# EAGLE design Aruduino-Kids-Shiled (EAGLE 6.6.0)
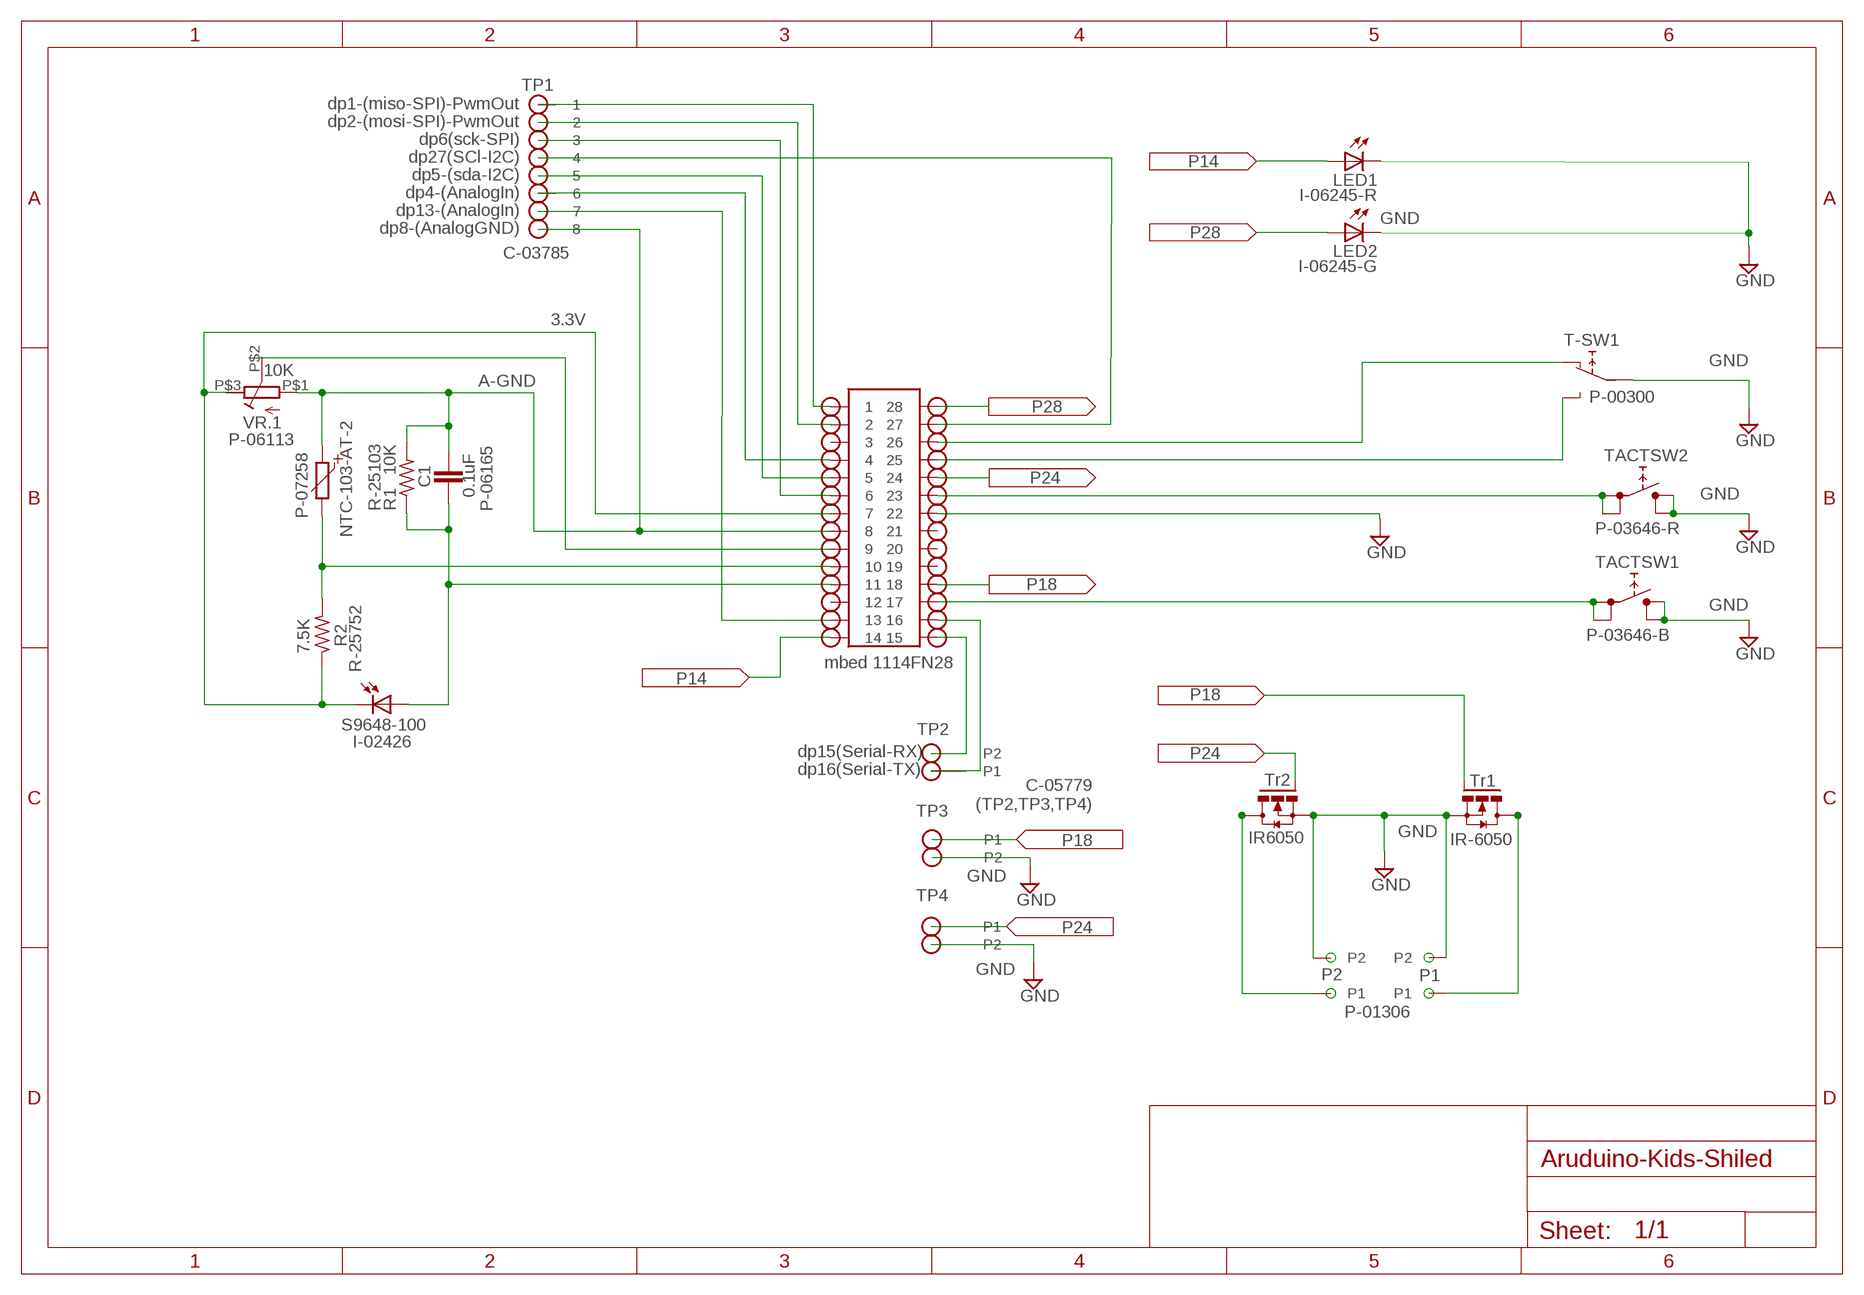
[diagram p0: schematic, sheet 1]

## Parts
0-50C  NTC-103-AT-2  [NTC]
C1  0.1uF  C-RPEF  [C]
LED1  I-06245-R  LED5MM  [LED5MM]
LED2  I-06245-G  LED5MM  [LED5MM]
R1  10K  R  [R12MM]
R2  7.5K  R  [R12MM]
T-SW1  P-00300  SW-2MS1-T1-B4-VS2-Q-E-TOGLE  [TOGLE-SW]
TACTSW1  P-03646-B  TACT-SW  [TACT-SW]
TACTSW2  P-03646-R  TACT-SW  [TACT-SW]
TB1  P-01306  TB112-2-2-U-1  [TB]
TB2  P-01306  TB112-2-2-U-1  [TB]
U$1  FH-1X14  [DIP28-SOCKET]
U$2  S9648-100  [PHOTO-IC]
U$3  SIPS-7  [SIPC-7]
U$4  IR-6050  ＩＲＦＵ１２０Ｎ  [TO251AA]
U$5  IR6050  ＩＲＦＵ１２０Ｎ  [TO251AA]
U$6  SIPS-2  [SIPC-2]
U$9  SIPS-2  [SIPC-2]
U$10  SIPS-2  [SIPC-2]
VR.1  10K  TSR-3386K  [VOL-TRIM]

## Nets
3.3V: R2.1 U$1.P$7 U$2.P$2(C) VR.1.P$3(E)
A-GND: 0-50C.1 C1.1 R1.2 U$1.P$8 U$3.P$8 VR.1.P$1(A)
GND: LED1.K(C) LED2.K(C) T-SW1.P$2(2COM) TACTSW1.1 TACTSW1.2 TACTSW2.1 TACTSW2.2 TB1.P$2(P2) TB2.P$2(P2) U$1.P$22 U$4.3(S) U$5.3(S) U$9.P$2(P2) U$10.P$2(P2)
N$5: C1.2 R1.1 U$1.P$11 U$2.P$1(A)
N$8: U$1.P$9 VR.1.P$2(S)
N$9: TACTSW1.3 TACTSW1.4 U$1.P$17
N$10: U$1.P$1 U$3.P$1
N$11: TACTSW2.3 TACTSW2.4 U$1.P$23
N$12: U$1.P$27 U$3.P$4
N$13: T-SW1.P$3 U$1.P$25
N$14: U$1.P$2 U$3.P$2
N$15: U$1.P$6 U$3.P$3
N$16: U$1.P$5 U$3.P$5
N$17: U$1.P$4 U$3.P$6
N$18: T-SW1.P$1 U$1.P$26
N$21: TB2.P$1(P1) U$5.2(D) U$5.4(D)
N$22: TB1.P$1(P1) U$4.2(D) U$4.4(D)
N$25: U$1.P$13 U$3.P$7
N$26: U$1.P$16 U$6.P$1(P1)
N$27: U$1.P$15 U$6.P$2(P2)
N$33: 0-50C.2 R2.2 U$1.P$10
P14: LED1.A U$1.P$14
P18: U$1.P$18 U$4.1(G) U$10.P$1(P1)
P24: U$1.P$24 U$5.1(G) U$9.P$1(P1)
P28: LED2.A U$1.P$28
Unconnected: U$1.P$3 U$1.P$12 U$1.P$19 U$1.P$20 U$1.P$21

## Notes on the sheet
- TP1
- dp1-(miso-SPI)-PwmOut
- dp2-(mosi-SPI)-PwmOut
- dp6(sck-SPI)
- dp27(SCl-I2C)
- dp5-(sda-I2C)
- dp4-(AnalogIn)
- dp13-(AnalogIn)
- dp8-(AnalogGND)
- C-03785
- P-06113 | R-25103 | P-06165
- P-07258
- R-25752
- mbed 1114FN28
- TP2
- I-02426
- dp15(Serial-RX)
- dp16(Serial-TX)
- Tr2 | Tr1
- C-05779
  (TP2,TP3,TP4)
- TP3
- TP4
- P2 | P1
- P-01306

## Library data of the parts
0-50C = Aruduino-Kids-Shiled:NTC-103-AT-2
C1 = Aruduino-Kids-Shiled:C-RPEF
LED1 LED2 = Aruduino-Kids-Shiled:LED5MM
R1 R2 = Aruduino-Kids-Shiled:R
T-SW1 = Aruduino-Kids-Shiled:SW-2MS1-T1-B4-VS2-Q-E-TOGLE
TACTSW1 TACTSW2 = Aruduino-Kids-Shiled:TACT-SW
TB1 TB2 = Aruduino-Kids-Shiled:TB112-2-2-U-1
U$1 = Aruduino-Kids-Shiled:FH-1X14
U$2 = Aruduino-Kids-Shiled:S9648-100
U$3 = Aruduino-Kids-Shiled:SIPS-7
U$4 U$5 = Aruduino-Kids-Shiled:ＩＲＦＵ１２０Ｎ
U$6 U$9 U$10 = Aruduino-Kids-Shiled:SIPS-2
VR.1 = Aruduino-Kids-Shiled:TSR-3386K

## Board
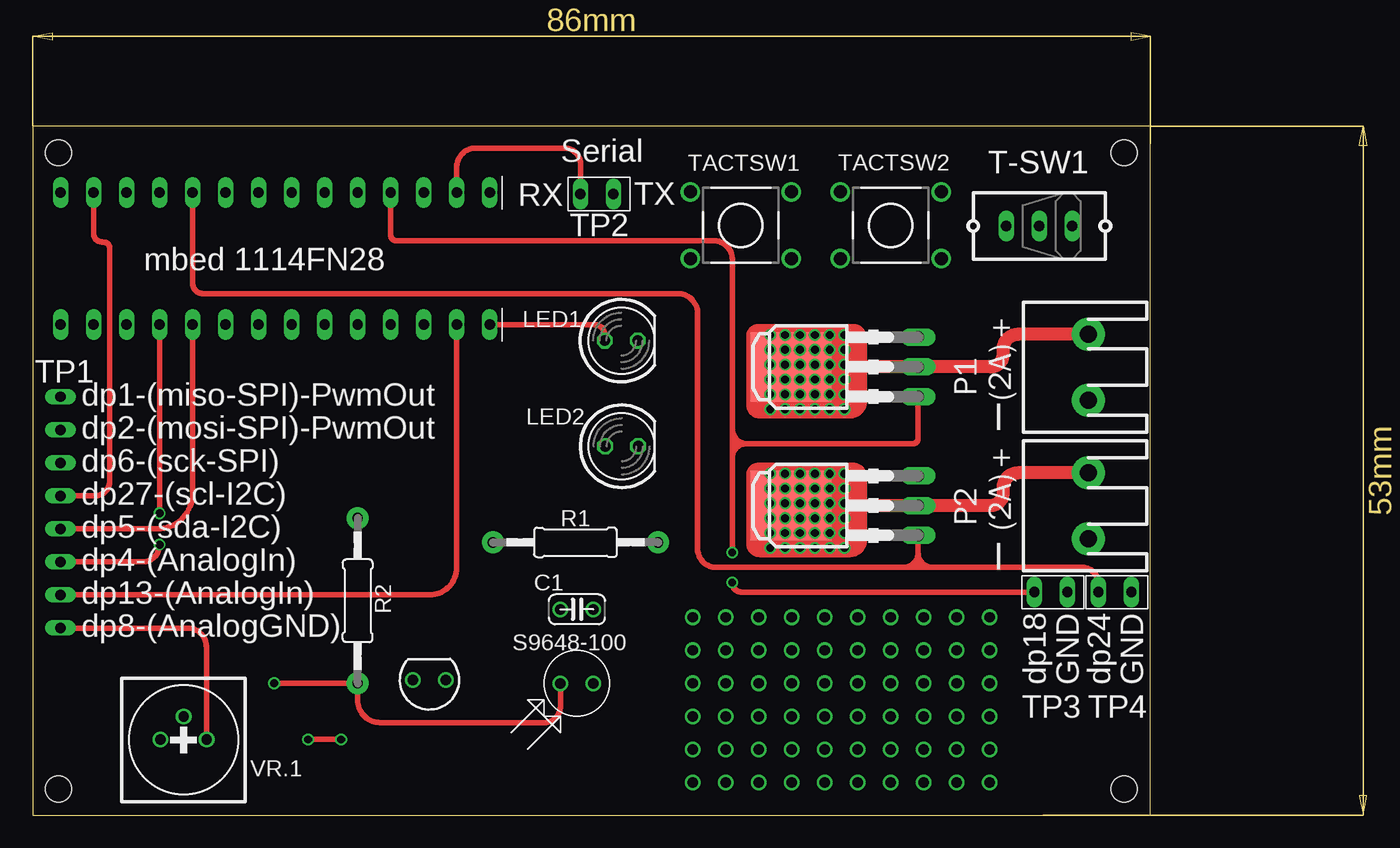
[diagram p1: board, top side]
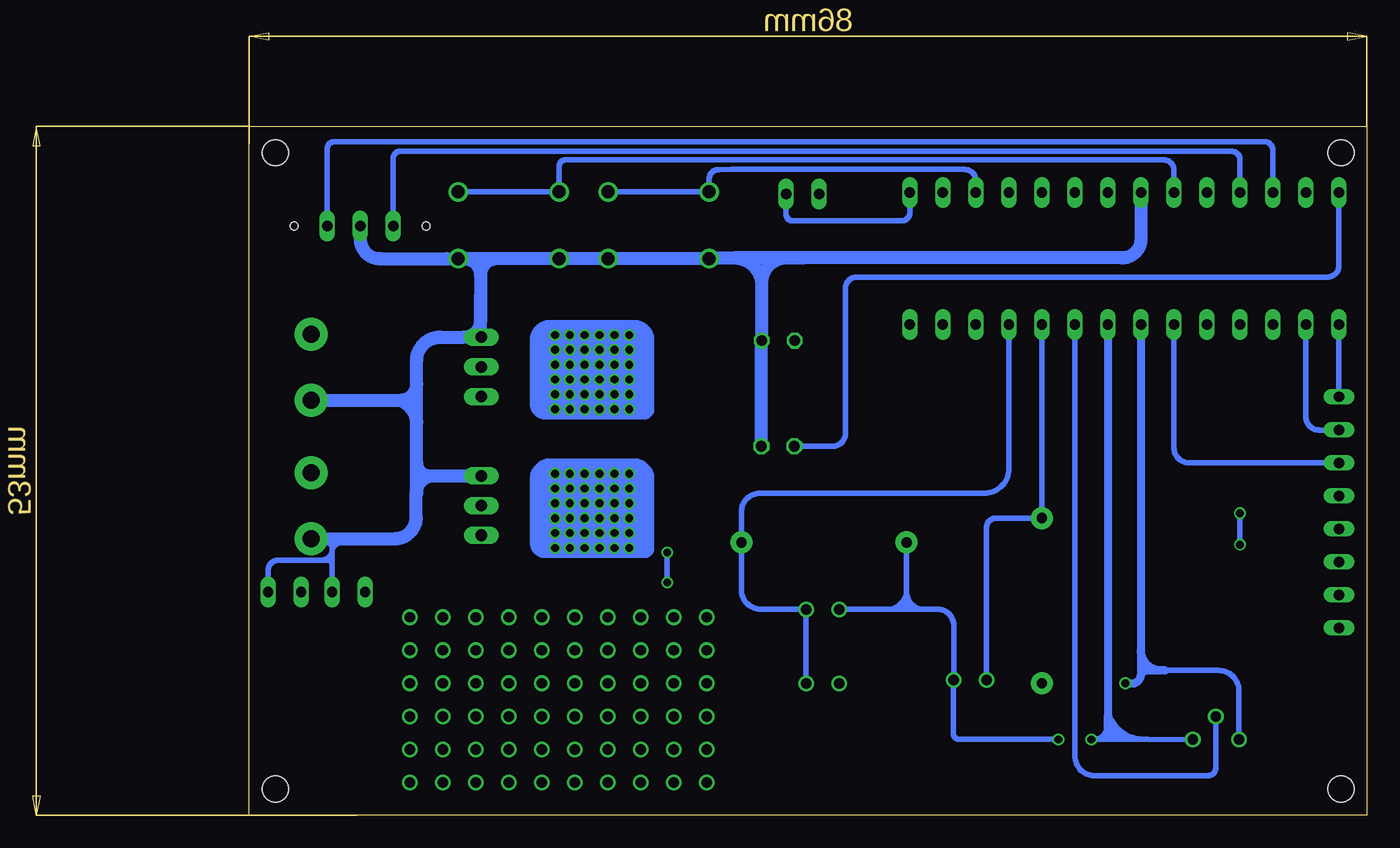
[diagram p2: board, bottom side, seen from below]

Size 86 x 53 mm. Coordinates in mm from the lower left corner, seen from the top.
Outline: 0.01,0 86,0 86,53 0,53 0.01,0
Copper layers (1*16): Top 0.035mm / dielectric 1.53mm / Bottom 0.035mm
Design rules "pban_5mil-l2": minimum track width 5mil, minimum drill 0.3mm, track to track 5mil, track to pad 0.229mm, pad to pad 5mil, via to via 5mil, smd to smd 5mil, copper to edge 0.5mm, drill to drill 0.5mm, minimum pad ring 0.15mm, minimum via ring 0.15mm, stop-mask expansion 4mil, vias tented up to drill 0.35mm, thermal gap 10mil
Holes 2 mm at 2,50.95 2.01,2 84,2 84,50.95

### Footprints (pad centres in the part's own frame; a part is rotated, then mirrored left to right if it is on the bottom)
NTC = drill 0.8: 1 -1.27,0; 2 1.27,0
C = drill 0.8: 1 -1.27,0; 2 1.27,0
LED5MM = drill 0.813 octagon: A -1.27,0; K 1.27,0
R12MM = drill 0.8 pad 1.676: 1 -6.35,0; 2 6.35,0
TOGLE-SW = drill 0.8 long: P$1 0,-2.54; P$2 0,0; P$3 0,2.54 | hole 0.6: 0,5.08; 0,-5.08
TACT-SW = drill 1: 1 -3.885,2.567; 2 3.885,2.567; 3 -3.885,-2.567; 4 3.885,-2.567
TB = drill 1.3 pad 2.54: P$1 0,2.54; P$2 0,-2.54
DIP28-SOCKET = drill 0.8 long: P$1 -5.08,16.51; P$2 -5.08,13.97; P$3 -5.08,11.43; P$4 -5.08,8.89; P$5 -5.08,6.35; P$6 -5.08,3.81; P$7 -5.08,1.27; P$8 -5.08,-1.27; P$9 -5.08,-3.81; P$10 -5.08,-6.35; P$11 -5.08,-8.89; P$12 -5.08,-11.43; P$13 -5.08,-13.97; P$14 -5.08,-16.51; P$15 5.08,-16.51; P$16 5.08,-13.97; P$17 5.08,-11.43; P$18 5.08,-8.89; P$19 5.08,-6.35; P$20 5.08,-3.81; P$21 5.08,-1.27; P$22 5.08,1.27; P$23 5.08,3.81; P$24 5.08,6.35; P$25 5.08,8.89; P$26 5.08,11.43; P$27 5.08,13.97; P$28 5.08,16.51
PHOTO-IC = drill 0.8: P$1 -1.27,0; P$2 1.27,0
SIPC-7 = drill 0.8 long: P$1 0,8.89; P$2 0,6.35; P$3 0,3.81; P$4 0,1.27; P$5 0,-1.27; P$6 0,-3.81; P$7 0,-6.35; P$8 0,-8.89
TO251AA = drill 0.889 long: 1 -2.286,-7.874; 2 0,-7.874; 3 2.286,-7.874 | smd 5.334 x 6.223: 4 0,1.905
SIPC-2 = drill 0.8 long: P$1 0,1.27; P$2 0,-1.27
VOL-TRIM = drill 0.8: P$1 1.775,0.025; P$2 0,1.8; P$3 -1.775,0.025

### Placement (x,y rotation side)
0-50C  30.54,10.4 180 top
C1  41.89,15.83 0 top
LED1  45.31,36.5 0 top
LED2  45.33,28.37 0 top
R1  41.78,20.98 180 top
R2  25.02,16.49 90 top
T-SW1  77.47,45.32 90 top
TACTSW1  54.51,45.37 180 top
TACTSW2  66.04,45.37 180 top
TB1  81.25,34.46 0 top
TB2  81.25,23.79 0 top
U$1  18.67,42.81 90 top
U$2  41.89,10.14 180 top
U$3  2.16,23.29 0 top
U$4  60.27,34.48 90 top
U$5  60.27,23.81 90 top
U$6  43.43,47.78 90 top
U$7  [A4L-LOC]  -82.78,-71.8 0 top  (outside the outline)
U$9  83.29,17.15 90 top
U$10  78.36,17.15 90 top
VR.1  11.63,5.79 0 top

### Tracks (layer width: path | path; a pad name or v marks a point on that pad's centre or on a via)
3.3V  (via drill 0.6)
  Top 0.406: v18.59,10.14 R2.1 25.02,8.85 arc90 26.75,7.12 39.42,7.12 arc90 40.62,8.31 40.62,8.92 arc90 40.62,8.93 U$2.P$2
  Bottom 0.406: 18.03,10.14 v18.59,10.14 | U$1.P$7 17.4,12.81 | 17.4,12.81 arc-90 15.72,11.13 15.52,11.13 11.43,11.13 arc90 9.86,9.56 VR.1.P$3 | 17.98,10.14 18.03,10.14 | 18.03,10.14 arc-90 17.4,10.78 17.4,12.71 17.4,12.81
  Bottom 0.61: U$1.P$7 17.4,12.71 | 17.4,12.71 17.4,10.83 arc90 18.11,10.12 18.52,10.12 | 15.52,11.13 15.82,11.13 arc90 17.4,12.71
A-GND  (via drill 0.6)
  Top 0.406: v21.21,5.82 v23.75,5.82 | U$3.P$8 arc90 2.17,14.38 9.53,14.38 10.13,14.38 11.94,14.38 arc-90 13.39,12.94 arc-90 13.41,12.92 VR.1.P$1
  Bottom 0.406: VR.1.P$1 17.07,5.83 arc90 20,8.59 | 20,8.59 U$1.P$8 | 20,8.59 arc-90 19.99,8.58 20.02,6.64 arc90 v21.21,5.82 | 31.83,10.39 arc90 0-50C.1 | 16.89,5.82 v21.21,5.82 | v21.21,5.82 19.94,5.82 19.94,7.09 19.68,7.09 19.68,6.08 19.56,6.08 | 18.8,6.08 19.56,6.08 | 19.56,6.08 19.56,6.59 19.18,6.59 19.18,6.33 | R1.2 35.43,17.28 | 35.43,17.28 arc90 36.88,15.83 C1.1 | C1.1 arc90 C1.1 | C1.1 34.29,15.83 | 34.29,15.83 arc90 34.29,15.83 | 34.29,15.83 34.11,15.83 | 34.11,15.83 33.02,15.83 arc90 31.8,14.61 31.8,10.42 arc90 0-50C.1 | v23.75,5.82 31.37,5.82 arc90 31.83,6.28 31.83,10.39 | 31.83,10.39 arc90 0-50C.1 | 35.43,17.28 35.43,17.15 arc-90 34.11,15.83
  Bottom 0.61: U$1.P$8 19.94,7.48
GND
  Bottom 0: U$4.3 arc90 U$4.3 71.4,36.76 arc-90 73.3,34.86 73.3,31.88 | 73.3,31.88 arc-90 73.34,31.92 TB1.P$2 arc-90 81.19,31.86 73.51,31.86 arc90 73.18,31.53 73.18,22.84 arc-90 73.23,22.79 73.23,22.23 arc90 73.99,21.47 74.04,21.47 arc90 74.26,21.25 | U$5.3 arc90 68.25,25.99 | 72.72,25.99 arc90 73.3,26.58 73.3,31.88 | 84.56,18.85 arc-90 84.45,18.96 84.45,19.29 arc90 84.18,19.56 83.95,19.56 arc90 83.92,19.59 83.39,19.59 arc90 83.36,19.62 79.63,19.62 | 69.47,42.8 arc90 69.49,42.78 71.55,42.78 arc-90 71.6,42.83 | 71.6,42.83 72.49,42.83 | 71.6,42.83 70.79,42.83 | 70.81,42.8 arc90 70.79,42.83 | 70.79,42.83 70.05,42.83
  Bottom 0.254: 78.28,21.24 arc90 78.05,21.47 73.99,21.47
  Bottom 0.406: U$10.P$2 79.63,19.62 79.63,21.24 | U$9.P$2 84.56,18.85 | 78.69,20.95 78.99,20.95 arc-90 79.63,20.3 | 79.63,20.02 79.63,19.29 arc-90 79.95,19.61 80.43,19.61 | 79.63,20.3 79.63,20.41 | 79.63,20.41 79.63,21.24 arc-90 79.64,21.25 | 84.56,18.81 arc90 83.75,19.61 80.43,19.61 | 80.43,19.61 arc-90 79.63,20.41 | 79.63,20.3 79.63,20.02 | 79.63,20.02 arc90 79.63,20.02 79.63,20.28 arc-90 79.64,20.29
  Bottom 1.016: LED2.K 46.6,36.48 arc90 LED1.K 46.58,40.74 arc-90 48.69,42.86 | 69.09,36.81 68.19,36.81 arc90 U$4.3 arc90 68.22,36.85 68.22,39.93 | 72.72,25.99 arc90 72.61,26.1 U$5.3 | TB2.P$2 arc-90 TB2.P$2 79.63,21.24 78.28,21.24 | 68.22,41.51 68.22,41.56 | 68.22,41.56 68.22,41.94 | 73.15,24.75 73.15,22.94 arc90 74.78,21.27 arc90 74.8,21.25 79.64,21.25 | 73.15,24.75 73.15,24.77 arc90 71.82,26.1 | 73.15,24.75 arc-90 73.13,24.77 73.13,27.08 | 73.13,27.08 73.13,30.23 | 73.13,30.23 73.13,33.15 | 73.13,33.15 73.13,34.96 arc90 71.32,36.77 arc-90 71.31,36.77 69.48,36.77 arc-90 68.22,38.03 68.22,38.08 arc90 68.23,38.08 68.23,39.93 arc90 68.22,39.93 | TB1.P$2 74.37,31.91 | 74.37,31.91 arc-90 73.13,33.15 | 74.37,31.91 arc60 73.13,30.23 | 73.13,27.08 arc-90 72.14,26.09 71.6,26.09 | U$1.P$22 17.4,44.3 arc90 18.85,42.86 48.69,42.86 | 50.57,42.86 arc-90 TACTSW1.2 | TACTSW1.2 TACTSW1.1 TACTSW2.2 | TACTSW2.2 69.47,42.8 | TACTSW2.2 66.93,42.8 arc-90 68.22,41.51 | 69.47,42.8 arc90 68.22,41.56 | 68.22,41.51 68.22,39.93 | 75.92,42.81 arc-90 75.92,42.8 | 75.92,42.8 70.81,42.8 TACTSW2.1 69.47,42.8 | TACTSW1.2 arc90 50.57,42.86 | 50.57,42.86 48.69,42.86 | T-SW1.P$2 77.47,44.3 arc-90 75.97,42.8 75.92,42.8
N$1  (via drill 0.8)
  other vias: 73.66,2.52
N$2  (via drill 0.8)
  other vias: 73.66,5.06
N$3  (via drill 0.8)
  other vias: 73.66,7.6
N$4
  Bottom 1.016: 44.57,42.86 45.24,42.86
N$5
  Bottom 0.406: U$1.P$11 27.56,26.65 arc90 29.46,24.75 46.74,24.75 arc-90 48.13,23.35 R1.1 48.13,17.51 arc-90 46.81,15.85 C1.2 arc-90 C1.2 U$2.P$1
N$6
  Bottom 1.016: 43.4,42.85 44.68,42.85 arc-90 46.58,40.95
N$8
  Bottom 0.406: U$1.P$9 22.48,4.55 arc-90 20.95,3.03 12.27,3.03 arc-90 11.63,3.67 VR.1.P$2
N$9
  Bottom 0.406: U$1.P$17 30.1,48.8 arc-90 30.96,49.66 48.9,49.66 49.88,49.66 arc-90 50.62,48.92 TACTSW1.4 | TACTSW1.4 TACTSW1.3 | TACTSW1.4 52.98,47.94 arc90 52.98,47.94 50.85,47.94 arc-90 50.61,48.18
N$10
  Bottom 0.406: U$1.P$1 U$3.P$1
N$11
  Bottom 0.406: U$1.P$23 14.86,49.61 arc-90 15.65,50.4 61.7,50.4 arc-90 62.15,49.94 TACTSW2.4 arc90 TACTSW2.4 TACTSW2.3
N$12
  Top 0.406: U$1.P$27 arc-90 U$1.P$27 4.7,44.76 arc90 5.38,44.08 5.45,44.08 arc-90 5.96,43.58 5.96,35.73 arc90 5.95,35.72 5.95,29.95 arc-90 5.95,29.94 5.95,25.73 arc-90 4.78,24.56 U$3.P$4
N$13
  Bottom 0.406: U$1.P$25 9.78,50.42 arc-90 10.41,51.05 74.36,51.08 arc-90 74.93,50.51 T-SW1.P$3
N$14
  Bottom 0.406: U$3.P$2 arc90 2.17,29.62 3.71,29.62 arc90 4.7,30.61 U$1.P$2
N$15
  Bottom 0.406: U$1.P$6 14.86,28.28 arc-90 13.68,27.1 U$3.P$3
N$16
  Top 0.406: U$1.P$5 12.32,24.75 arc-90 9.59,22.02 U$3.P$5
N$17  (via drill 0.6)
  Top 0.406: U$1.P$4 v9.78,23.22 | v9.78,20.81 arc-90 8.45,19.48 U$3.P$6
  Bottom 0.406: v9.78,23.22 v9.78,20.81
N$18
  Bottom 0.406: U$1.P$26 7.24,51.11 arc-90 7.95,51.82 79.44,51.82 arc-90 80.01,51.24 T-SW1.P$1
N$19  (via drill 0.8)
  other vias: 73.66,10.14
N$20  (via drill 0.8)
  other vias: 73.66,12.68
N$21
  Top 1.016: TB2.P$1 arc-90 TB2.P$1 75.82,26.32 arc90 74.68,25.18 74.68,24.75 arc-90 73.74,23.81 U$5.2 U$5.4
N$22
  Top 1.016: U$4.2 arc-90 68.19,34.53 | TB1.P$1 arc-90 TB1.P$1 75.84,36.99 arc90 74.68,35.82 74.68,35.41 arc-90 73.74,34.48 U$4.2 | U$4.2 U$4.4
N$23  (via drill 0.8)
  other vias: 73.66,15.22
N$24  (via drill 0.8)
  other vias: 71.12,15.22
N$25
  Top 0.406: U$1.P$13 32.64,19.03 arc-90 30.55,16.94 U$3.P$7
N$26
  Top 0.406: U$6.P$1 42.16,50.1 arc90 40.95,51.31 34.11,51.31 arc90 32.64,49.84 U$1.P$16
N$27
  Bottom 0.406: U$1.P$15 35.18,46.34 arc90 35.81,45.7 44.15,45.7 arc90 44.7,46.26 U$6.P$2
N$28  (via drill 0.8)
  other vias: 68.58,15.22
N$29
  Top 0.406: 69.19,19.06 67.54,19.06
N$30
  Top 0.406: 55.24,36.94 arc90 55.12,36.81 | 55.12,36.81 arc-90 55.88,37.57 63.12,37.57 arc-90 64.01,36.69 64.01,31.86 arc-90 62.87,30.72 56.01,30.72 arc-90 55.12,31.61 55.12,35.54 55.12,36.81
N$33
  Bottom 0.406: U$1.P$10 25.02,24.43 25.02,23.43 | 0-50C.2 29.27,22.14 arc90 28.57,22.84 25.61,22.84 | 25.61,22.84 R2.2 25.02,23.43 | 25.02,23.43 arc90 25.61,22.84
N$35
  Bottom 0.406: 35.48,16.39 35.48,16.34 arc-90 35.2,16.06 35.71,16.06 arc90 35.74,16.09
N$36  (via drill 0.8)
  other vias: 66.04,15.22
N$37  (via drill 0.8)
  other vias: 63.5,15.22
N$38  (via drill 0.8)
  other vias: 60.96,15.22
N$39  (via drill 0.8)
  other vias: 58.42,15.22
N$40  (via drill 0.8)
  other vias: 55.88,15.22
N$41  (via drill 0.8)
  other vias: 53.34,15.22
N$42  (via drill 0.8)
  other vias: 50.8,15.22
N$43  (via drill 0.8)
  other vias: 50.8,12.68
N$44  (via drill 0.8)
  other vias: 50.8,10.14
N$45  (via drill 0.8)
  other vias: 50.8,7.6
N$46  (via drill 0.8)
  other vias: 50.8,5.06
N$47  (via drill 0.8)
  other vias: 50.8,2.52
N$48
  Top 0.406: 60.96,33.84 60.96,34.53
N$54  (via drill 0.8)
  other vias: 53.34,2.52
N$55  (via drill 0.8)
  other vias: 53.34,5.06
N$56
  Top 1.016: 63.63,36.18 62.1,36.18
N$59  (via drill 0.8)
  other vias: 53.34,7.6
N$60  (via drill 0.8)
  other vias: 53.34,10.14
N$61  (via drill 0.8)
  other vias: 53.34,12.68
N$62  (via drill 0.8)
  other vias: 55.88,12.68
N$63  (via drill 0.8)
  other vias: 55.88,10.14
N$64  (via drill 0.8)
  other vias: 55.88,7.6
N$65  (via drill 0.8)
  other vias: 55.88,5.06
N$66  (via drill 0.8)
  other vias: 55.88,2.52
N$67  (via drill 0.8)
  other vias: 58.42,2.52
N$68  (via drill 0.8)
  other vias: 58.42,5.06
N$69  (via drill 0.8)
  other vias: 58.42,7.6
N$70  (via drill 0.8)
  other vias: 58.42,10.14
N$71  (via drill 0.8)
  other vias: 58.42,12.68
N$72  (via drill 0.8)
  other vias: 60.96,12.68
N$73  (via drill 0.8)
  other vias: 60.96,10.14
N$74  (via drill 0.8)
  other vias: 60.96,7.6
N$75  (via drill 0.8)
  other vias: 60.96,5.06
N$76  (via drill 0.8)
  other vias: 60.96,2.52
N$77  (via drill 0.8)
  other vias: 63.5,2.52
N$78  (via drill 0.8)
  other vias: 63.5,5.06
N$79  (via drill 0.8)
  other vias: 63.5,7.6
N$80  (via drill 0.8)
  other vias: 66.04,10.14
N$81  (via drill 0.8)
  other vias: 63.5,12.68
N$82  (via drill 0.8)
  other vias: 63.5,10.14
N$83  (via drill 0.8)
  other vias: 66.04,12.68
N$84  (via drill 0.8)
  other vias: 68.58,12.68
N$93  (via drill 0.8)
  other vias: 71.12,12.68
N$94  (via drill 0.8)
  other vias: 71.12,10.14
N$95  (via drill 0.8)
  other vias: 68.58,10.14
N$96  (via drill 0.8)
  other vias: 68.58,7.6
N$97  (via drill 0.8)
  other vias: 66.04,7.6
N$100
  Top 1.016: 62.1,35.8 62.1,31.99 62.87,31.99 62.87,35.8
N$101  (via drill 0.6)
  Top 0.61: 59.82,33.89 58.67,33.89 58.67,33.51 v59.05,33.51 59.82,33.51 60.2,34.27 | 60.2,34.27 v60.2,34.65 v59.05,34.65 v57.91,34.65 v57.91,33.51 57.91,33.13 58.29,33.13 | 60.2,34.27 58.29,34.27 58.29,33.13 | 60.2,34.27 v60.2,33.51 60.2,33.13 | 60.2,33.13 58.29,33.13 | 60.58,35.03 60.58,32.75 57.91,32.75 57.53,34.65 58.67,35.03 60.58,35.03 | 60.58,35.03 60.2,33.13 | 60.58,35.03 60.58,35.41 58.29,35.41 57.15,35.03 57.53,32.37 v57.91,32.37 v59.05,32.37 v60.2,32.37 60.96,32.37 60.96,35.8
N$102
  Top 0.61: 60.58,25.51 57.91,25.51 56.39,25.13 56.77,21.7
N$103  (via drill 0.8)
  other vias: 66.04,5.06
N$104  (via drill 0.8)
  other vias: 66.04,2.52
N$105  (via drill 0.8)
  other vias: 68.58,2.52
N$106  (via drill 0.8)
  other vias: 68.58,5.06
N$107  (via drill 0.8)
  other vias: 71.12,5.06
N$108  (via drill 0.8)
  other vias: 71.12,7.6
N$109  (via drill 0.8)
  other vias: 71.12,2.52
N$110
  Top 1.016: 63.63,34.65 63.63,31.61 63.25,31.61
N$112
  Top 1.016: 63.63,23.98 63.63,20.94 63.25,20.94
N$116
  Top 0.406: 55.24,26.27 arc90 55.12,26.14 | 55.12,26.14 arc-90 55.88,26.91 63.12,26.91 arc-90 64.01,26.02 64.01,21.19 arc-90 62.87,20.05 56.01,20.05 arc-90 55.12,20.94 55.12,24.87 55.12,26.14
N$117
  Top 0.61: 57.15,22.08 56.77,24.75 57.91,25.13 60.2,25.13 60.2,24.75 | 57.53,22.46 57.15,24.37 58.29,24.75 60.2,24.75 | 60.2,24.75 59.82,22.84 | 57.91,22.84 57.53,22.84 57.53,24.37 59.82,24.37 59.82,23.98 | 59.82,23.98 59.82,22.84 | 59.82,22.84 57.91,22.84 | 57.91,22.84 57.91,23.98 59.82,23.98 | 59.82,23.98 59.44,23.22 58.29,23.22 58.29,23.6 59.44,23.6
N$119
  Bottom 0.254: 20.12,7.65 20.12,6.79 arc90 21.01,5.9
N$120
  Bottom 0.254: 19.76,8.64 19.76,7.7
N$121
  Bottom 0.254: 15.95,10.96 16.9,10.96 arc-90 17.25,10.61
N$122
  Bottom 0.254: 16.87,11.26 16.94,11.26 arc-90 17.08,11.12 16.84,11.12
N$123
  Top 0.406: 60.96,23.17 60.96,23.86
N$124
  Top 1.016: 63.63,25.51 62.1,25.51
N$127
  Bottom 0.406: 79.64,20.32 arc-90 79.63,20.32 | 79.63,20.32 79.63,20.4 | 79.63,20.32 79.63,19.84 arc90 79.64,19.85 79.64,20.61 arc-90 79.97,20.95
N$130
  Top 0.61: 56.01,25.51 57.53,25.89
N$131
  Top 1.016: 62.1,25.13 62.1,21.32 62.87,21.32 62.87,25.13
N$133  (via drill 0.6)
  Top 0.61: 59.82,23.22 58.67,23.22 58.67,22.84 v59.05,22.84 59.82,22.84 60.2,23.6 | 60.2,23.6 v60.2,23.98 v59.05,23.98 v57.91,23.98 v57.91,22.84 57.91,22.46 58.29,22.46 | 60.2,23.6 58.29,23.6 58.29,22.46 | 60.2,23.6 v60.2,22.84 60.2,22.46 | 60.2,22.46 58.29,22.46 | 60.58,24.37 60.58,22.08 57.91,22.08 57.53,23.98 58.67,24.37 60.58,24.37 | 60.58,24.37 60.2,22.46 | 60.58,24.37 60.58,24.75 58.29,24.75 57.15,24.37 57.53,21.7 v57.91,21.7 v59.05,21.7 v60.2,21.7 60.96,21.7 60.96,25.13
N$134
  Top 0.61: 56.77,25.89 61.72,25.89 61.72,20.94 56.77,20.94 56.39,25.13 57.91,25.51
N$135  (via drill 0.6)
  other vias: 56.77,23.98
N$136  (via drill 0.6)
  other vias: 62.48,23.98
N$137  (via drill 0.6)
  other vias: 62.48,22.84
N$138  (via drill 0.6)
  other vias: 56.77,22.84
N$139  (via drill 0.6)
  other vias: 56.77,25.13
N$140  (via drill 0.6)
  other vias: 56.77,21.7
N$141  (via drill 0.6)
  other vias: 62.48,21.7
N$142  (via drill 0.6)
  other vias: 57.91,25.13
N$143  (via drill 0.6)
  other vias: 57.91,26.27
N$144  (via drill 0.6)
  other vias: 59.05,25.13
N$145  (via drill 0.6)
  other vias: 60.2,25.13
N$146  (via drill 0.6)
  other vias: 62.48,25.13
N$147
  Bottom 0.813: 55.24,25.89 55.24,20.56 arc90 55.63,20.18 63.25,20.18 arc90 64.01,20.94 64.01,25.89 arc90 62.87,27.03 56.39,27.03 arc90 55.24,25.89
N$148  (via drill 0.6)
  Top 0.61: 55.63,25.51 arc-90 56.01,25.89 | 56.01,25.51 56.39,23.6 56.39,21.32 56.01,20.94 | 61.34,25.51 v61.34,25.13 v61.34,23.98 v61.34,22.84 v61.34,21.7 61.34,21.32 57.15,21.32 56.77,24.75 58.29,25.13 58.67,25.13
  Top 1.016: 63.63,26.27 v62.48,26.27 v61.34,26.27 v60.2,26.27 v59.05,26.27 v56.77,26.27 | v56.77,26.27 55.63,26.27 55.63,25.51 55.63,20.94 56.01,20.94 56.01,20.56 v56.77,20.56 v57.91,20.56 v59.05,20.56 v60.2,20.56 v61.34,20.56 v62.48,20.56 63.25,20.56 | v56.77,26.27 56.77,24.75 56.39,25.51 v61.34,25.13 63.63,24.75
  Bottom 0.813: 56.39,26.65 56.01,26.65 56.01,25.51 63.25,25.51 63.25,26.27 62.87,26.27 62.87,26.65 63.25,26.65 63.25,20.94 55.63,20.94 55.63,21.32 56.01,21.32 56.01,25.13 61.72,25.13 61.72,23.98 61.72,21.7 57.53,21.7 57.53,24.75 60.96,24.75 60.96,24.37 60.58,24.37 60.58,22.08 58.67,22.08 58.67,22.46 58.29,22.46 58.29,23.22 60.2,23.22
  Bottom 1.016: 57.91,26.27 v56.77,26.27 v56.77,20.56 v57.91,20.56 | 57.91,26.27 v59.05,26.27 | v59.05,26.27 v60.2,26.27 | v60.2,26.27 v61.34,26.27 | v61.34,26.27 v62.48,26.27 v62.48,20.56 v61.34,20.56 | v61.34,20.56 v60.2,20.56 | v60.2,20.56 v59.05,20.56 | v59.05,20.56 v57.91,20.56 | 63.63,23.98 63.63,25.13 56.01,25.13 55.63,25.13 55.63,23.98 | 63.63,23.98 63.63,22.84 | 63.63,22.84 63.63,21.7 61.72,21.7 55.63,21.7 55.63,22.84 | 55.63,22.84 55.63,23.98 | 55.63,23.98 61.72,23.98 63.63,23.98 | 63.63,22.84 55.63,22.84 | 57.91,26.27 v57.91,20.56 | v59.05,20.56 v59.05,26.27 | v60.2,26.27 60.2,23.22 v60.2,20.56 | v61.34,20.56 v61.34,26.27
N$149
  Top 0.61: 56.77,36.56 61.72,36.56 61.72,31.61 56.77,31.61 56.39,35.8 57.91,36.18
N$154  (via drill 0.6)
  other vias: 56.77,34.65
N$155  (via drill 0.6)
  other vias: 62.48,34.65
N$158  (via drill 0.6)
  other vias: 62.48,33.51
N$159  (via drill 0.6)
  other vias: 56.77,33.51
N$160  (via drill 0.6)
  other vias: 56.77,35.8
N$161  (via drill 0.6)
  other vias: 56.77,32.37
N$162  (via drill 0.6)
  other vias: 62.48,32.37
N$163  (via drill 0.6)
  other vias: 57.91,35.8
N$164  (via drill 0.6)
  other vias: 57.91,36.94
N$165  (via drill 0.6)
  other vias: 59.05,35.8
N$166  (via drill 0.6)
  other vias: 60.2,35.8
N$167  (via drill 0.6)
  other vias: 62.48,35.8
N$168
  Bottom 0.813: 55.24,36.56 55.24,31.22 arc90 55.63,30.84 63.25,30.84 arc90 64.01,31.61 64.01,36.56 arc90 62.87,37.7 56.39,37.7 arc90 55.24,36.56
N$169  (via drill 0.6)
  Top 0.61: 55.63,36.18 arc-90 56.01,36.56 | 56.01,36.18 56.39,34.27 56.39,31.99 56.01,31.61 | 61.34,36.18 v61.34,35.8 v61.34,34.65 v61.34,33.51 v61.34,32.37 61.34,31.99 57.15,31.99 56.77,35.41 58.29,35.8 58.67,35.8
  Top 1.016: 63.63,36.94 v62.48,36.94 v61.34,36.94 v60.2,36.94 v59.05,36.94 v56.77,36.94 | v56.77,36.94 55.63,36.94 55.63,36.18 55.63,31.61 56.01,31.61 56.01,31.22 v56.77,31.22 v57.91,31.22 v59.05,31.22 v60.2,31.22 v61.34,31.22 v62.48,31.22 63.25,31.22 | v56.77,36.94 56.77,35.41 56.39,36.18 v61.34,35.8 63.63,35.41
  Bottom 0.813: 56.39,37.32 56.01,37.32 56.01,36.18 63.25,36.18 63.25,36.94 62.87,36.94 62.87,37.32 63.25,37.32 63.25,31.61 55.63,31.61 55.63,31.99 56.01,31.99 56.01,35.8 61.72,35.8 61.72,34.65 61.72,32.37 57.53,32.37 57.53,35.41 60.96,35.41 60.96,35.03 60.58,35.03 60.58,32.75 58.67,32.75 58.67,33.13 58.29,33.13 58.29,33.89 60.2,33.89
  Bottom 1.016: 57.91,36.94 v56.77,36.94 v56.77,31.22 v57.91,31.22 | 57.91,36.94 v59.05,36.94 | v59.05,36.94 v60.2,36.94 | v60.2,36.94 v61.34,36.94 | v61.34,36.94 v62.48,36.94 v62.48,31.22 v61.34,31.22 | v61.34,31.22 v60.2,31.22 | v60.2,31.22 v59.05,31.22 | v59.05,31.22 v57.91,31.22 | 63.63,34.65 63.63,35.8 56.01,35.8 55.63,35.8 55.63,34.65 | 63.63,34.65 63.63,33.51 | 63.63,33.51 63.63,32.37 61.72,32.37 55.63,32.37 55.63,33.51 | 55.63,33.51 55.63,34.65 | 55.63,34.65 61.72,34.65 63.63,34.65 | 63.63,33.51 55.63,33.51 | 57.91,36.94 v57.91,31.22 | v59.05,31.22 v59.05,36.94 | v60.2,36.94 60.2,33.89 v60.2,31.22 | v61.34,31.22 v61.34,36.94
P14
  Top 0.406: LED1.A arc-90 LED1.A 44.04,36.94 arc90 43.24,37.73 U$1.P$14
P18  (via drill 0.6)
  Top 0.406: U$1.P$18 27.56,44.64 arc90 28.02,44.18 52.45,44.18 arc-90 53.85,42.78 53.85,29.7 | 53.85,29.7 arc90 54.99,28.56 | 54.99,28.56 67.69,28.56 arc90 68.15,29.01 U$4.1 | 53.85,28.05 53.85,29.7 | 54.36,28.56 54.86,28.56 | 54.86,28.56 54.99,28.56 | 54.36,28.56 arc90 53.85,28.05 | 53.98,28.56 54.36,28.56 | v53.85,20.2 53.85,27.54 | 53.85,27.54 53.85,28.05 | U$10.P$1 54.59,17.15 arc-90 v53.85,17.89 | 53.85,27.54 arc-90 54.86,28.56
  Bottom 0.406: 53.85,19.16 v53.85,20.2 v53.85,17.89
P24
  Top 0.406: 68.12,21.53 U$5.1 68.15,20.13 | U$1.P$24 12.32,40.93 arc90 13.13,40.11 49.66,40.11 arc-90 51.18,38.59 51.18,20.48 arc90 52.6,19.06 66.78,19.06 67.06,19.06 | 67.06,19.06 67.21,19.06 | 67.21,19.06 67.79,19.06 arc90 68.15,19.41 68.15,20.13 | U$9.P$1 82.02,17.81 arc90 80.77,19.06 69.22,19.06 arc-90 68.15,20.13 | 68.15,20.05 68.15,20 arc-90 67.21,19.06 | 67.06,19.06 arc90 68.15,20.15
P28
  Bottom 0.406: LED2.A 41.12,28.37 arc-90 40.13,29.36 40.13,40.52 arc90 39.27,41.38 3.05,41.38 arc-90 2.16,42.28 2.16,45.95 | 2.16,45.95 2.16,46.43 U$1.P$28 | 2.16,45.95 arc-90 2.16,45.95 arc90 2.16,45.95

### Text on the board
tNames: Serial | RX | TX | TP2 | mbed 1114FN28 | TP1 | dp1-(miso-SPI)-PwmOut | dp2-(mosi-SPI)-PwmOut | P1 / ー(2A)＋ | dp6-(sck-SPI) | dp27-(scl-I2C) | dp5-(sda-I2C) | dp4-(AnalogIn) | P2 / ー (2A)＋ | dp13-(AnalogIn) | dp8-(AnalogGND) | dp18 | GND | dp24 | GND | TP3 | TP4
tDocu: Tr1 | Tr2 | NTC | PHOTO-IC